# Altium schematic sheet RK3399_PowerPins.SchDoc
size B; Organization: Altium Limited; Address1: L3, 12a Rodborough Rd; Address2: Frenchs Forest; Address3: NSW; Address4: Australia 2086
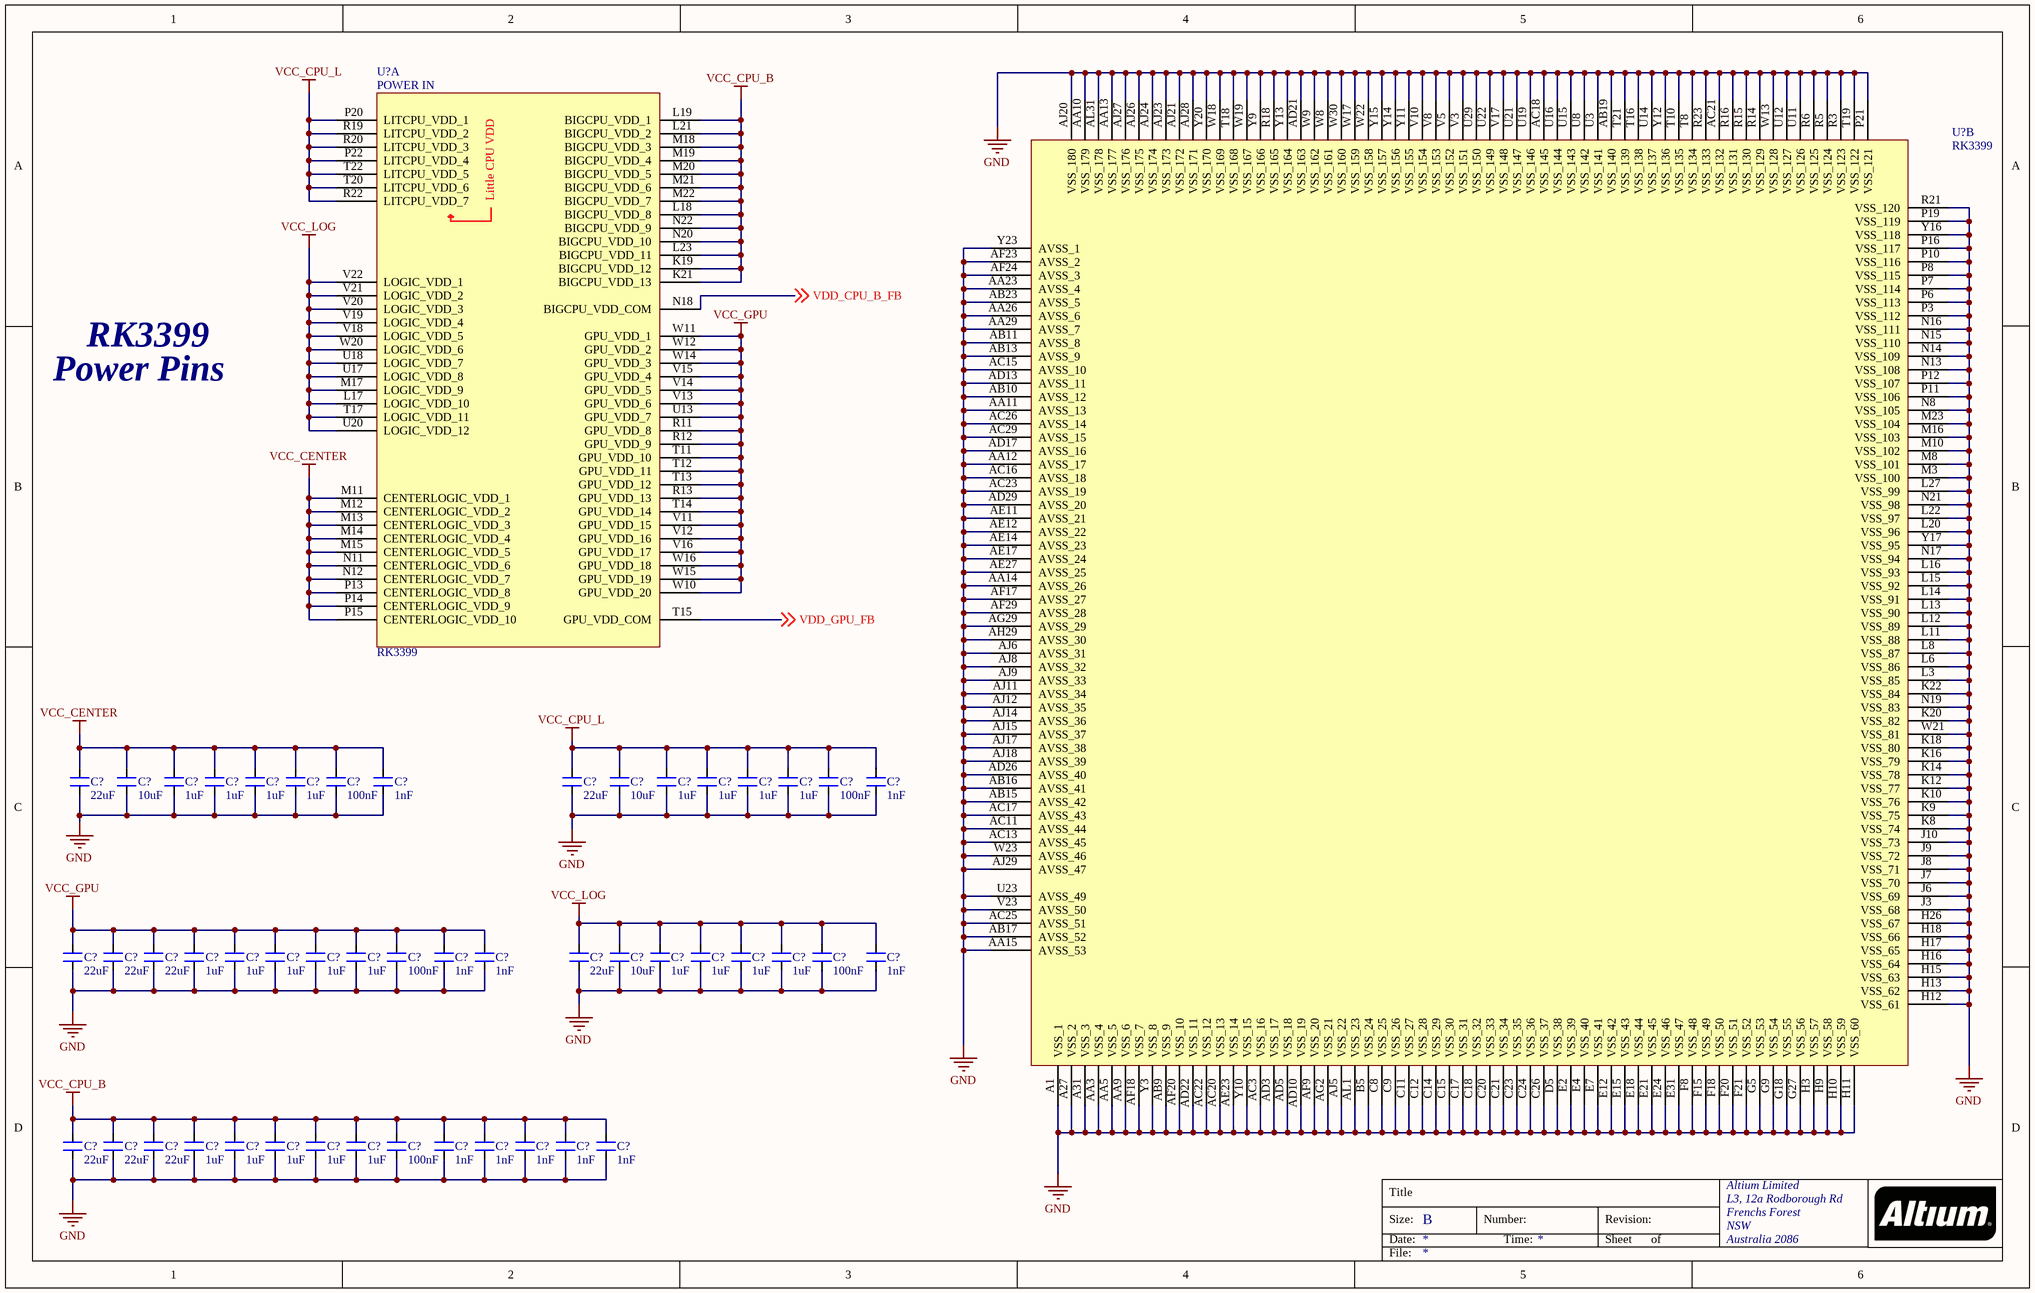
[diagram p0: RK3399_PowerPins.SchDoc]

## Parts
(Parts that share a designator on the sheet are numbered #1, #2 ... from top to bottom, then left to right.)
C?#1  22uF  [CAP_0603]
C?#2  10uF  [CAP_0603]
C?#3  1uF  [CAP_0201]
C?#4  1uF  [CAP_0201]
C?#5  1uF  [CAP_0201]
C?#6  1uF  [CAP_0201]
C?#7  100nF  [CAP_0201]
C?#8  1nF  [CAP_0201]
C?#9  22uF  [CAP_0603]
C?#10  10uF  [CAP_0603]
C?#11  1uF  [CAP_0201]
C?#12  1uF  [CAP_0201]
C?#13  1uF  [CAP_0201]
C?#14  1uF  [CAP_0201]
C?#15  100nF  [CAP_0201]
C?#16  1nF  [CAP_0201]
C?#17  22uF  [CAP_0603]
C?#18  22uF  [CAP_0603]
C?#19  22uF  [CAP_0603]
C?#20  1uF  [CAP_0201]
C?#21  1uF  [CAP_0201]
C?#22  1uF  [CAP_0201]
C?#23  1uF  [CAP_0201]
C?#24  1uF  [CAP_0201]
C?#25  100nF  [CAP_0201]
C?#26  1nF  [CAP_0201]
C?#27  1nF  [CAP_0201]
C?#28  22uF  [CAP_0603]
C?#29  10uF  [CAP_0603]
C?#30  1uF  [CAP_0201]
C?#31  1uF  [CAP_0201]
C?#32  1uF  [CAP_0201]
C?#33  1uF  [CAP_0201]
C?#34  100nF  [CAP_0201]
C?#35  1nF  [CAP_0201]
C?#36  22uF  [CAP_0603]
C?#37  22uF  [CAP_0603]
C?#38  22uF  [CAP_0603]
C?#39  1uF  [CAP_0201]
C?#40  1uF  [CAP_0201]
C?#41  1uF  [CAP_0201]
C?#42  1uF  [CAP_0201]
C?#43  1uF  [CAP_0201]
C?#44  100nF  [CAP_0201]
C?#45  1nF  [CAP_0201]
C?#46  1nF  [CAP_0201]
C?#47  1nF  [CAP_0201]
C?#48  1nF  [CAP_0201]
C?#49  1nF  [CAP_0201]
U?#1  RK3399  [FBGA828_23_826X826]  (part A of 24)
U?#2  RK3399  [FBGA828_23_826X826]  (part B of 24)

## Nets
GND: C?#1.1 C?#2.1 C?#3.1 C?#4.1 C?#5.1 C?#6.1 C?#7.1 C?#8.1 C?#9.1 C?#10.1 C?#11.1 C?#12.1 C?#13.1 C?#14.1 C?#15.1 C?#16.1 C?#17.1 C?#18.1 C?#19.1 C?#20.1 C?#21.1 C?#22.1 C?#23.1 C?#24.1 C?#25.1 C?#26.1 C?#27.1 C?#28.1 C?#29.1 C?#30.1 C?#31.1 C?#32.1 C?#33.1 C?#34.1 C?#35.1 C?#36.1 C?#37.1 C?#38.1 C?#39.1 C?#40.1 C?#41.1 C?#42.1 C?#43.1 C?#44.1 C?#45.1 C?#46.1 C?#47.1 C?#48.1 C?#49.1 U?#2.A1(VSS_1) U?#2.A27(VSS_2) U?#2.A31(VSS_3) U?#2.AA3(VSS_4) U?#2.AA5(VSS_5) U?#2.AA9(VSS_6) U?#2.AA10(VSS_179) U?#2.AA11(AVSS_13) U?#2.AA12(AVSS_17) U?#2.AA13(VSS_177) U?#2.AA14(AVSS_26) U?#2.AA15(AVSS_53) U?#2.AA23(AVSS_4) U?#2.AA26(AVSS_6) U?#2.AA29(AVSS_7) U?#2.AB9(VSS_9) U?#2.AB10(AVSS_12) U?#2.AB11(AVSS_8) U?#2.AB13(AVSS_9) U?#2.AB15(AVSS_42) U?#2.AB16(AVSS_41) U?#2.AB17(AVSS_52) U?#2.AB19(VSS_140) U?#2.AB23(AVSS_5) U?#2.AC3(VSS_16) U?#2.AC11(AVSS_44) U?#2.AC13(AVSS_45) U?#2.AC15(AVSS_10) U?#2.AC16(AVSS_18) U?#2.AC17(AVSS_43) U?#2.AC18(VSS_145) U?#2.AC20(VSS_13) U?#2.AC21(VSS_132) U?#2.AC22(VSS_12) U?#2.AC23(AVSS_19) U?#2.AC25(AVSS_51) U?#2.AC26(AVSS_14) U?#2.AC29(AVSS_15) U?#2.AD3(VSS_17) U?#2.AD5(VSS_18) U?#2.AD10(VSS_19) U?#2.AD13(AVSS_11) U?#2.AD17(AVSS_16) U?#2.AD21(VSS_163) U?#2.AD22(VSS_11) U?#2.AD26(AVSS_40) U?#2.AD29(AVSS_20) U?#2.AE11(AVSS_21) U?#2.AE12(AVSS_22) U?#2.AE14(AVSS_23) U?#2.AE17(AVSS_24) U?#2.AE23(VSS_14) U?#2.AE27(AVSS_25) U?#2.AF9(VSS_20) U?#2.AF17(AVSS_27) U?#2.AF18(VSS_7) U?#2.AF20(VSS_10) U?#2.AF23(AVSS_2) U?#2.AF24(AVSS_3) U?#2.AF29(AVSS_28) U?#2.AG2(VSS_21) U?#2.AG29(AVSS_29) U?#2.AH29(AVSS_30) U?#2.AJ5(VSS_22) U?#2.AJ6(AVSS_31) U?#2.AJ8(AVSS_32) U?#2.AJ9(AVSS_33) U?#2.AJ11(AVSS_34) U?#2.AJ12(AVSS_35) U?#2.AJ14(AVSS_36) U?#2.AJ15(AVSS_37) U?#2.AJ17(AVSS_38) U?#2.AJ18(AVSS_39) U?#2.AJ20(VSS_180) U?#2.AJ21(VSS_172) U?#2.AJ23(VSS_173) U?#2.AJ24(VSS_174) U?#2.AJ26(VSS_175) U?#2.AJ27(VSS_176) U?#2.AJ28(VSS_171) U?#2.AJ29(AVSS_47) U?#2.AL1(VSS_23) U?#2.AL31(VSS_178) U?#2.B5(VSS_24) U?#2.C8(VSS_25) U?#2.C9(VSS_26) U?#2.C11(VSS_27) U?#2.C12(VSS_28) U?#2.C14(VSS_29) U?#2.C15(VSS_30) U?#2.C17(VSS_31) U?#2.C18(VSS_32) U?#2.C20(VSS_33) U?#2.C21(VSS_34) U?#2.C23(VSS_35) U?#2.C24(VSS_36) U?#2.C26(VSS_37) U?#2.D5(VSS_38) U?#2.E2(VSS_39) U?#2.E4(VSS_40) U?#2.E7(VSS_41) U?#2.E12(VSS_42) U?#2.E15(VSS_43) U?#2.E18(VSS_44) U?#2.E21(VSS_45) U?#2.E24(VSS_46) U?#2.E31(VSS_47) U?#2.F8(VSS_48) U?#2.F15(VSS_49) U?#2.F18(VSS_50) U?#2.F20(VSS_51) U?#2.F21(VSS_52) U?#2.G5(VSS_53) U?#2.G9(VSS_54) U?#2.G18(VSS_55) U?#2.G27(VSS_56) U?#2.H3(VSS_57) U?#2.H9(VSS_58) U?#2.H10(VSS_59) U?#2.H11(VSS_60) U?#2.H12(VSS_61) U?#2.H13(VSS_62) U?#2.H15(VSS_63) U?#2.H16(VSS_64) U?#2.H17(VSS_65) U?#2.H18(VSS_66) U?#2.H26(VSS_67) U?#2.J3(VSS_68) U?#2.J6(VSS_69) U?#2.J7(VSS_70) U?#2.J8(VSS_71) U?#2.J9(VSS_72) U?#2.J10(VSS_73) U?#2.K8(VSS_74) U?#2.K9(VSS_75) U?#2.K10(VSS_76) U?#2.K12(VSS_77) U?#2.K14(VSS_78) U?#2.K16(VSS_79) U?#2.K18(VSS_80) U?#2.K20(VSS_82) U?#2.K22(VSS_84) U?#2.L3(VSS_85) U?#2.L6(VSS_86) U?#2.L8(VSS_87) U?#2.L11(VSS_88) U?#2.L12(VSS_89) U?#2.L13(VSS_90) U?#2.L14(VSS_91) U?#2.L15(VSS_92) U?#2.L16(VSS_93) U?#2.L20(VSS_96) U?#2.L22(VSS_97) U?#2.L27(VSS_99) U?#2.M3(VSS_100) U?#2.M8(VSS_101) U?#2.M10(VSS_102) U?#2.M16(VSS_103) U?#2.M23(VSS_104) U?#2.N8(VSS_105) U?#2.N13(VSS_108) U?#2.N14(VSS_109) U?#2.N15(VSS_110) U?#2.N16(VSS_111) U?#2.N17(VSS_94) U?#2.N19(VSS_83) U?#2.N21(VSS_98) U?#2.P3(VSS_112) U?#2.P6(VSS_113) U?#2.P7(VSS_114) U?#2.P8(VSS_115) U?#2.P10(VSS_116) U?#2.P11(VSS_106) U?#2.P12(VSS_107) U?#2.P16(VSS_117) U?#2.P19(VSS_119) U?#2.P21(VSS_121) U?#2.R3(VSS_123) U?#2.R5(VSS_124) U?#2.R6(VSS_125) U?#2.R14(VSS_129) U?#2.R15(VSS_130) U?#2.R16(VSS_131) U?#2.R18(VSS_165) U?#2.R21(VSS_120) U?#2.R23(VSS_133) U?#2.T8(VSS_134) U?#2.T10(VSS_135) U?#2.T16(VSS_138) U?#2.T18(VSS_168) U?#2.T19(VSS_122) U?#2.T21(VSS_139) U?#2.U3(VSS_141) U?#2.U8(VSS_142) U?#2.U11(VSS_126) U?#2.U12(VSS_127) U?#2.U14(VSS_137) U?#2.U15(VSS_143) U?#2.U16(VSS_144) U?#2.U19(VSS_146) U?#2.U21(VSS_147) U?#2.U22(VSS_149) U?#2.U23(AVSS_49) U?#2.U29(VSS_150) U?#2.V3(VSS_151) U?#2.V5(VSS_152) U?#2.V8(VSS_153) U?#2.V10(VSS_154) U?#2.V17(VSS_148) U?#2.V23(AVSS_50) U?#2.W8(VSS_161) U?#2.W9(VSS_162) U?#2.W13(VSS_128) U?#2.W17(VSS_159) U?#2.W18(VSS_169) U?#2.W19(VSS_167) U?#2.W21(VSS_81) U?#2.W22(VSS_158) U?#2.W23(AVSS_46) U?#2.W30(VSS_160) U?#2.Y3(VSS_8) U?#2.Y9(VSS_166) U?#2.Y10(VSS_15) U?#2.Y11(VSS_155) U?#2.Y12(VSS_136) U?#2.Y13(VSS_164) U?#2.Y14(VSS_156) U?#2.Y15(VSS_157) U?#2.Y16(VSS_118) U?#2.Y17(VSS_95) U?#2.Y20(VSS_170) U?#2.Y23(AVSS_1)
VCC_CENTER: C?#1.2 C?#2.2 C?#3.2 C?#4.2 C?#5.2 C?#6.2 C?#7.2 C?#8.2 U?#1.M11(CENTERLOGIC_VDD_1) U?#1.M12(CENTERLOGIC_VDD_2) U?#1.M13(CENTERLOGIC_VDD_3) U?#1.M14(CENTERLOGIC_VDD_4) U?#1.M15(CENTERLOGIC_VDD_5) U?#1.N11(CENTERLOGIC_VDD_6) U?#1.N12(CENTERLOGIC_VDD_7) U?#1.P13(CENTERLOGIC_VDD_8) U?#1.P14(CENTERLOGIC_VDD_9) U?#1.P15(CENTERLOGIC_VDD_10)
VCC_CPU_B: C?#36.2 C?#37.2 C?#38.2 C?#39.2 C?#40.2 C?#41.2 C?#42.2 C?#43.2 C?#44.2 C?#45.2 C?#46.2 C?#47.2 C?#48.2 C?#49.2 U?#1.K19(BIGCPU_VDD_12) U?#1.K21(BIGCPU_VDD_13) U?#1.L18(BIGCPU_VDD_8) U?#1.L19(BIGCPU_VDD_1) U?#1.L21(BIGCPU_VDD_2) U?#1.L23(BIGCPU_VDD_11) U?#1.M18(BIGCPU_VDD_3) U?#1.M19(BIGCPU_VDD_4) U?#1.M20(BIGCPU_VDD_5) U?#1.M21(BIGCPU_VDD_6) U?#1.M22(BIGCPU_VDD_7) U?#1.N20(BIGCPU_VDD_10) U?#1.N22(BIGCPU_VDD_9)
VCC_CPU_L: C?#9.2 C?#10.2 C?#11.2 C?#12.2 C?#13.2 C?#14.2 C?#15.2 C?#16.2 U?#1.P20(LITCPU_VDD_1) U?#1.P22(LITCPU_VDD_4) U?#1.R19(LITCPU_VDD_2) U?#1.R20(LITCPU_VDD_3) U?#1.R22(LITCPU_VDD_7) U?#1.T20(LITCPU_VDD_6) U?#1.T22(LITCPU_VDD_5)
VCC_GPU: C?#17.2 C?#18.2 C?#19.2 C?#20.2 C?#21.2 C?#22.2 C?#23.2 C?#24.2 C?#25.2 C?#26.2 C?#27.2 U?#1.R11(GPU_VDD_8) U?#1.R12(GPU_VDD_9) U?#1.R13(GPU_VDD_13) U?#1.T11(GPU_VDD_10) U?#1.T12(GPU_VDD_11) U?#1.T13(GPU_VDD_12) U?#1.T14(GPU_VDD_14) U?#1.U13(GPU_VDD_7) U?#1.V11(GPU_VDD_15) U?#1.V12(GPU_VDD_16) U?#1.V13(GPU_VDD_6) U?#1.V14(GPU_VDD_5) U?#1.V15(GPU_VDD_4) U?#1.V16(GPU_VDD_17) U?#1.W10(GPU_VDD_20) U?#1.W11(GPU_VDD_1) U?#1.W12(GPU_VDD_2) U?#1.W14(GPU_VDD_3) U?#1.W15(GPU_VDD_19) U?#1.W16(GPU_VDD_18)
VCC_LOG: C?#28.2 C?#29.2 C?#30.2 C?#31.2 C?#32.2 C?#33.2 C?#34.2 C?#35.2 U?#1.L17(LOGIC_VDD_10) U?#1.M17(LOGIC_VDD_9) U?#1.T17(LOGIC_VDD_11) U?#1.U17(LOGIC_VDD_8) U?#1.U18(LOGIC_VDD_7) U?#1.U20(LOGIC_VDD_12) U?#1.V18(LOGIC_VDD_5) U?#1.V19(LOGIC_VDD_4) U?#1.V20(LOGIC_VDD_3) U?#1.V21(LOGIC_VDD_2) U?#1.V22(LOGIC_VDD_1) U?#1.W20(LOGIC_VDD_6)
VDD_CPU_B_FB: U?#1.N18(BIGCPU_VDD_COM) ; off-sheet VDD_CPU_B_FB
VDD_GPU_FB: U?#1.T15(GPU_VDD_COM) ; off-sheet VDD_GPU_FB

## Notes on the sheet
- RK3399
- Power Pins
- Title
- Size:
- Date:
- B
- Number:
- Time:
- Revision:
- Sheet
- of
- File:
- (in symbol IC_RK3399-FCBGA828, part A) POWER IN; Little CPU VDD

## Library data of the parts
C?#1 C?#9 C?#17-C?#19 C?#28 C?#36-C?#38 = CAP_22uF-10V-20%-0603: 22µF ±20% 10V Ceramic Capacitor X5R 0603 (1608 Metric) /; Manufacturer: Murata Electronics; Manufacturer Part Number: GRM188R61A226ME15D; Case/Package: 0603; Supplier-1: Digikey
C?#2 C?#10 C?#29 = CAP_10uF-25V-10%-0603: 10µF ±10% 25V Ceramic Capacitor X5R 0603 (1608 Metric) /; Manufacturer: Murata Electronics; Manufacturer Part Number: GRM188R61E106KA73D; Case/Package: 0603; Supplier-1: Digikey
C?#3-C?#6 C?#11-C?#14 C?#20-C?#24 C?#30-C?#33 C?#39-C?#43 = CAP_1uF-16V-10%-0201: 1µF ±20% 16V Ceramic Capacitor X5R 0201 (0603 Metric) /; Manufacturer: Samsung Electro-Mechanics; Manufacturer Part Number: CL03A105MO3NRNH; Case/Package: 0201; Supplier-1: Digikey
C?#7 C?#15 C?#25 C?#34 C?#44 = CAP_100nF-25V-10%-0201: 0.1µF ±10% 25V Ceramic Capacitor X5R 0201 (0603 Metric) /; Manufacturer: TDK Corporation; Manufacturer Part Number: C0603X5R1E104K030BB; Case/Package: 0201; Supplier-1: Digikey
C?#8 C?#16 C?#26 C?#27 C?#35 C?#45-C?#49 = CAP_1nF-16V-10%-0201: 1000pF ±10% 16V Ceramic Capacitor X7R 0201 (0603 Metric) /; Manufacturer: Murata Electronics; Manufacturer Part Number: GRM033R71C102KA01D; Case/Package: 0201; Supplier-1: Digikey
U?#1 U?#2 = IC_RK3399-FCBGA828: RK3399 is a low power, high performance processor for computing, personal mobile.; Manufacturer: Rockchip; Manufacturer Part Number: RK3399; Case/Package: FCBGA828; Supplier-1: Rockchip